# EAGLE design integration_test_board (EAGLE 6.3)
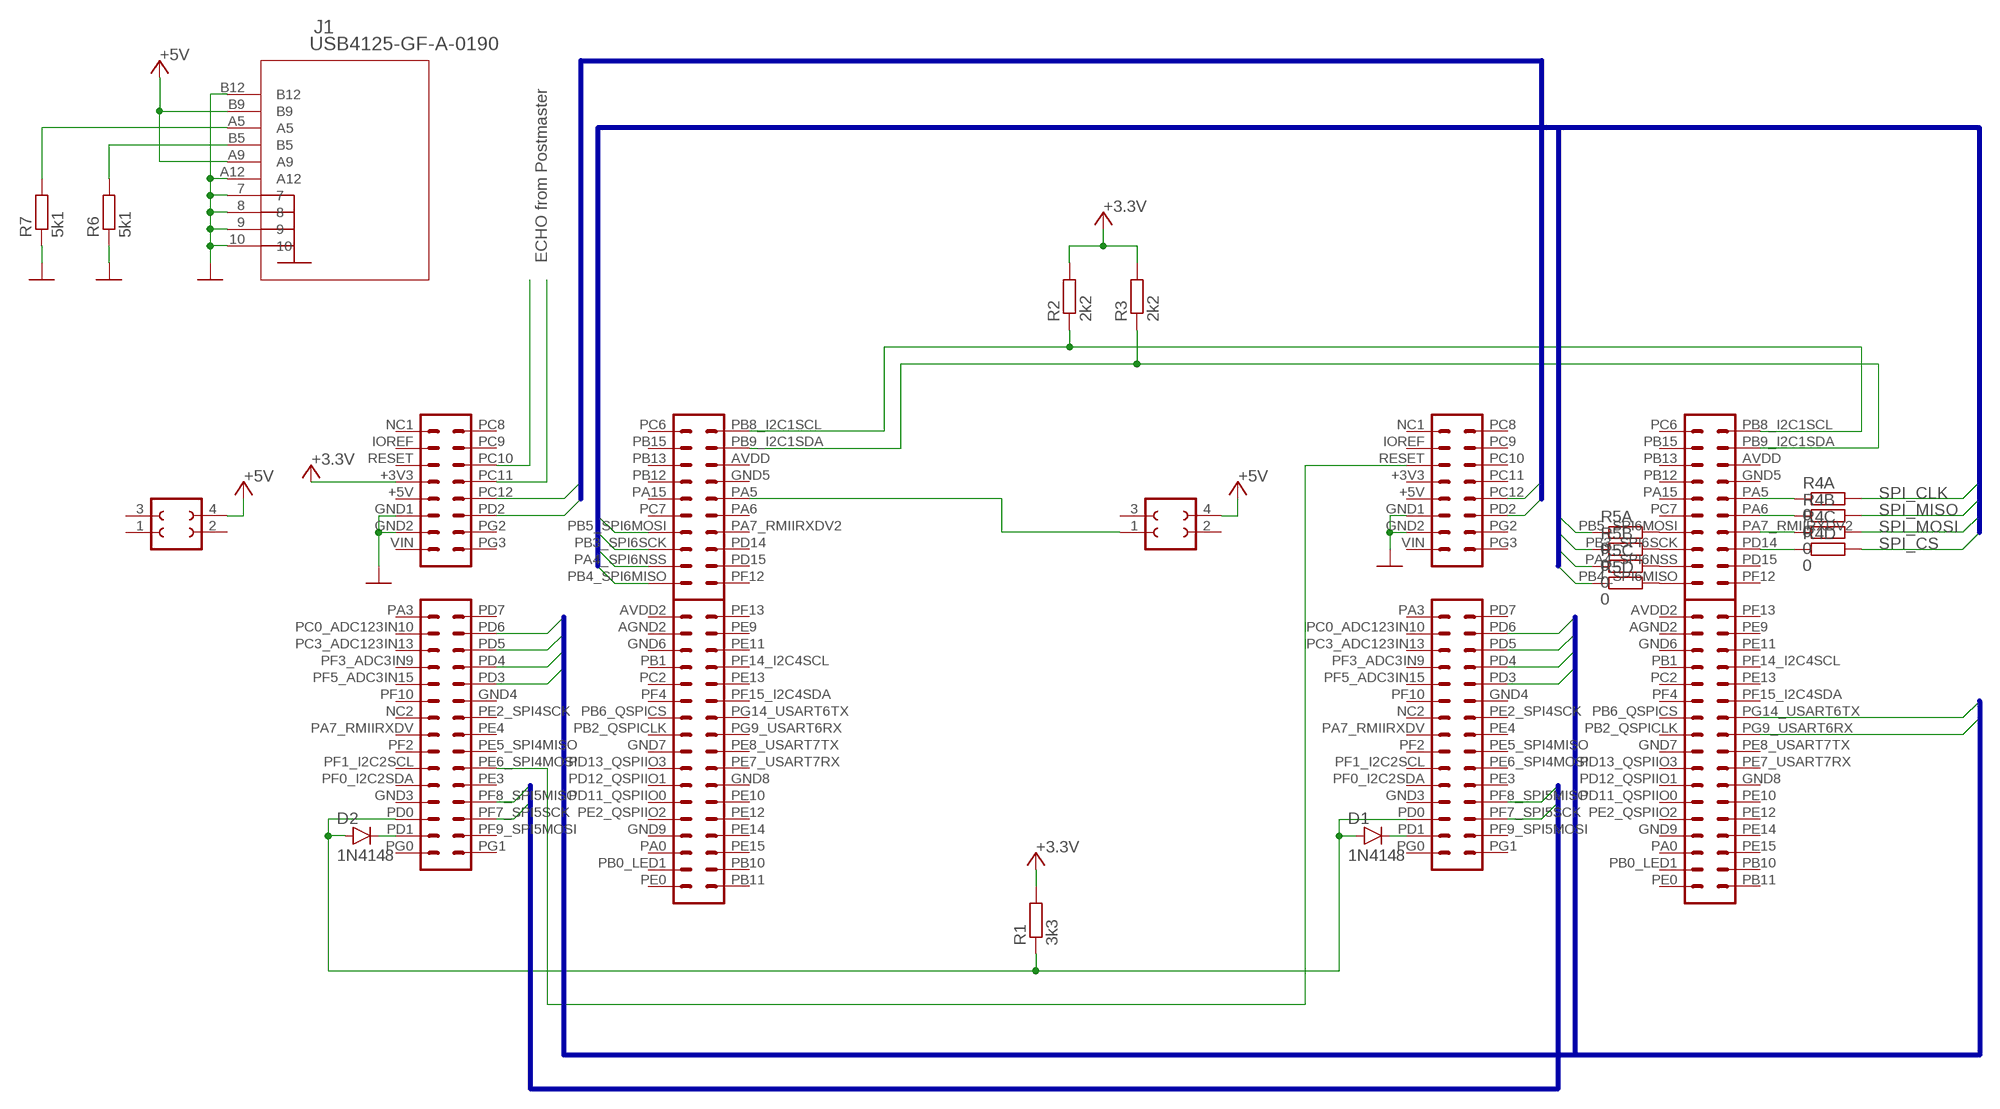
[diagram p0: schematic, sheet 1]

## Parts
D1  1N4148  [MINIMELF]
D2  1N4148  [MINIMELF]
J1  USB4125-GF-A-0190  [CONN6_125-GF-A-0190_GCT]
R1  3k3  RESISTORR0805  [0805]
R2  2k2  RESISTORR0805  [0805]
R3  2k2  RESISTORR0805  [0805]
R4  0  ARRAY-4RESISTOR  [ARRAY0603X4]
R5  0  ARRAY-4RESISTOR  [ARRAY0603X4]
R6  5k1  RESISTORR0805  [0805]
R7  5k1  RESISTORR0805  [0805]
U$1  NUCLEO-767  [NUCLEO-767]
U$2  NUCLEO-767  [NUCLEO-767]
U$4  HEADER-FEMALE-2-2  [HEADER-FEMALE-2-2]
U$5  HEADER-FEMALE-2-2  [HEADER-FEMALE-2-2]

## Nets
0V: J1.7 J1.8 J1.9 J1.10 J1.A12 J1.B12 R6.1 R7.1 U$1.GND1 U$1.GND2 U$2.GND1 U$2.GND2
+3.3V: R1.2 R2.2 R3.2 U$1.+3V3
+5V: J1.A9 J1.B9 U$4.4 U$5.4
ECHO_RX: U$1.PC12 U$2.PD2
ECHO_TX: U$1.PD2 U$2.PC12
GPIO_IN: U$1.PF7_SPI5SCK U$2.PF7_SPI5SCK
GPIO_OUT: U$1.PF8_SPI5MISO U$2.PF8_SPI5MISO
N$1: D1.A D2.A R1.1 U$1.PD0 U$2.PD0
N$2: D1.C U$2.PD1
N$3: D2.C U$1.PD1
N$4: R2.1 U$1.PB8_I2C1SCL U$2.PB8_I2C1SCL
N$5: R3.1 U$1.PB9_I2C1SDA U$2.PB9_I2C1SDA
N$6: U$1.PC10
N$7: U$1.PC11
N$8: U$1.PE6_SPI4MOSI U$2.RESET
N$9: R4.4 U$2.PD14
N$10: R4.3 U$2.PA7_RMIIRXDV2
N$11: R4.2 U$2.PA6
N$12: R4.1 U$2.PA5
N$13: R5.8 U$2.PB5_SPI6MOSI
N$14: R5.7 U$2.PB3_SPI6SCK
N$15: R5.6 U$2.PA4_SPI6NSS
N$16: R5.5 U$2.PB4_SPI6MISO
N$17: J1.B5 R6.2
N$18: J1.A5 R7.2
N$21: U$1.PA5 U$4.1
SPI_CLK: R4.8 R5.2 U$1.PB3_SPI6SCK
SPI_CS: R4.5 R5.3 U$1.PA4_SPI6NSS
SPI_MISO: R4.7 R5.4 U$1.PB4_SPI6MISO
SPI_MOSI: R4.6 R5.1 U$1.PB5_SPI6MOSI
UART_CTS: U$1.PD4 U$2.PD3
UART_RTR: U$1.PD3 U$2.PD4
UART_RX: U$1.PD5 U$2.PD6 U$2.PG9_USART6RX
UART_TX: U$1.PD6 U$2.PD5 U$2.PG14_USART6TX
Unconnected: U$1.+5V U$1.AGND2 U$1.AVDD U$1.AVDD2 U$1.GND3 U$1.GND4 U$1.GND5 U$1.GND6 U$1.GND7 U$1.GND8 U$1.GND9 U$1.IOREF U$1.NC1 U$1.NC2 U$1.PA0 U$1.PA3 U$1.PA6 U$1.PA7_RMIIRXDV U$1.PA7_RMIIRXDV2 U$1.PA15 U$1.PB0_LED1 U$1.PB1 U$1.PB2_QSPICLK U$1.PB6_QSPICS U$1.PB10 U$1.PB11 U$1.PB12 U$1.PB13 U$1.PB15 U$1.PC0_ADC123IN10 U$1.PC2 U$1.PC3_ADC123IN13 U$1.PC6 U$1.PC7 U$1.PC8 U$1.PC9 U$1.PD7 U$1.PD11_QSPIIO0 U$1.PD12_QSPIIO1 U$1.PD13_QSPIIO3 U$1.PD14 U$1.PD15 U$1.PE0 U$1.PE2_QSPIIO2 U$1.PE2_SPI4SCK U$1.PE3 U$1.PE4 U$1.PE5_SPI4MISO U$1.PE7_USART7RX U$1.PE8_USART7TX U$1.PE9 U$1.PE10 U$1.PE11 U$1.PE12 U$1.PE13 U$1.PE14 U$1.PE15 U$1.PF0_I2C2SDA U$1.PF1_I2C2SCL U$1.PF2 U$1.PF3_ADC3IN9 U$1.PF4 U$1.PF5_ADC3IN15 U$1.PF9_SPI5MOSI U$1.PF10 U$1.PF12 U$1.PF13 U$1.PF14_I2C4SCL U$1.PF15_I2C4SDA U$1.PG0 U$1.PG1 U$1.PG2 U$1.PG3 U$1.PG9_USART6RX U$1.PG14_USART6TX U$1.RESET U$1.VIN U$2.+3V3 U$2.+5V U$2.AGND2 U$2.AVDD U$2.AVDD2 U$2.GND3 U$2.GND4 U$2.GND5 U$2.GND6 U$2.GND7 U$2.GND8 U$2.GND9 U$2.IOREF U$2.NC1 U$2.NC2 U$2.PA0 U$2.PA3 U$2.PA7_RMIIRXDV U$2.PA15 U$2.PB0_LED1 U$2.PB1 U$2.PB2_QSPICLK U$2.PB6_QSPICS U$2.PB10 U$2.PB11 U$2.PB12 U$2.PB13 U$2.PB15 U$2.PC0_ADC123IN10 U$2.PC2 U$2.PC3_ADC123IN13 U$2.PC6 U$2.PC7 U$2.PC8 U$2.PC9 U$2.PC10 U$2.PC11 U$2.PD7 U$2.PD11_QSPIIO0 U$2.PD12_QSPIIO1 U$2.PD13_QSPIIO3 U$2.PD15 U$2.PE0 U$2.PE2_QSPIIO2 U$2.PE2_SPI4SCK U$2.PE3 U$2.PE4 U$2.PE5_SPI4MISO U$2.PE6_SPI4MOSI U$2.PE7_USART7RX U$2.PE8_USART7TX U$2.PE9 U$2.PE10 U$2.PE11 U$2.PE12 U$2.PE13 U$2.PE14 U$2.PE15 U$2.PF0_I2C2SDA U$2.PF1_I2C2SCL U$2.PF2 U$2.PF3_ADC3IN9 U$2.PF4 U$2.PF5_ADC3IN15 U$2.PF9_SPI5MOSI U$2.PF10 U$2.PF12 U$2.PF13 U$2.PF14_I2C4SCL U$2.PF15_I2C4SDA U$2.PG0 U$2.PG1 U$2.PG2 U$2.PG3 U$2.VIN U$4.2 U$4.3 U$5.1 U$5.2 U$5.3

## Buses
SPI_CS,SPI_CLK,SPI_MISO,SPI_MOSI
UART_TX,UART_RX,UART_RTR,UART_CTS
ECHO_TX,ECHO_RX
GPIO_IN,GPIO_OUT

## Notes on the sheet
- ECHO from Postmaster

## Library data of the parts
D1 D2 = diode:1N4148
J1 = header:USB4125-GF-A-0190; COPYRIGHT: Copyright (C) 2023 Ultra Librarian. All rights reserved.; MANUFACTURER_PART_NUMBER: USB4125-GF-A-0190; MFR_NAME: Global Connector Technology
R1-R3 R6 R7 = passive:RESISTOR
R4 R5 = passive:ARRAY-4RESISTOR
U$1 U$2 = header:NUCLEO-767
U$4 U$5 = header:HEADER-FEMALE-2-2

## Board
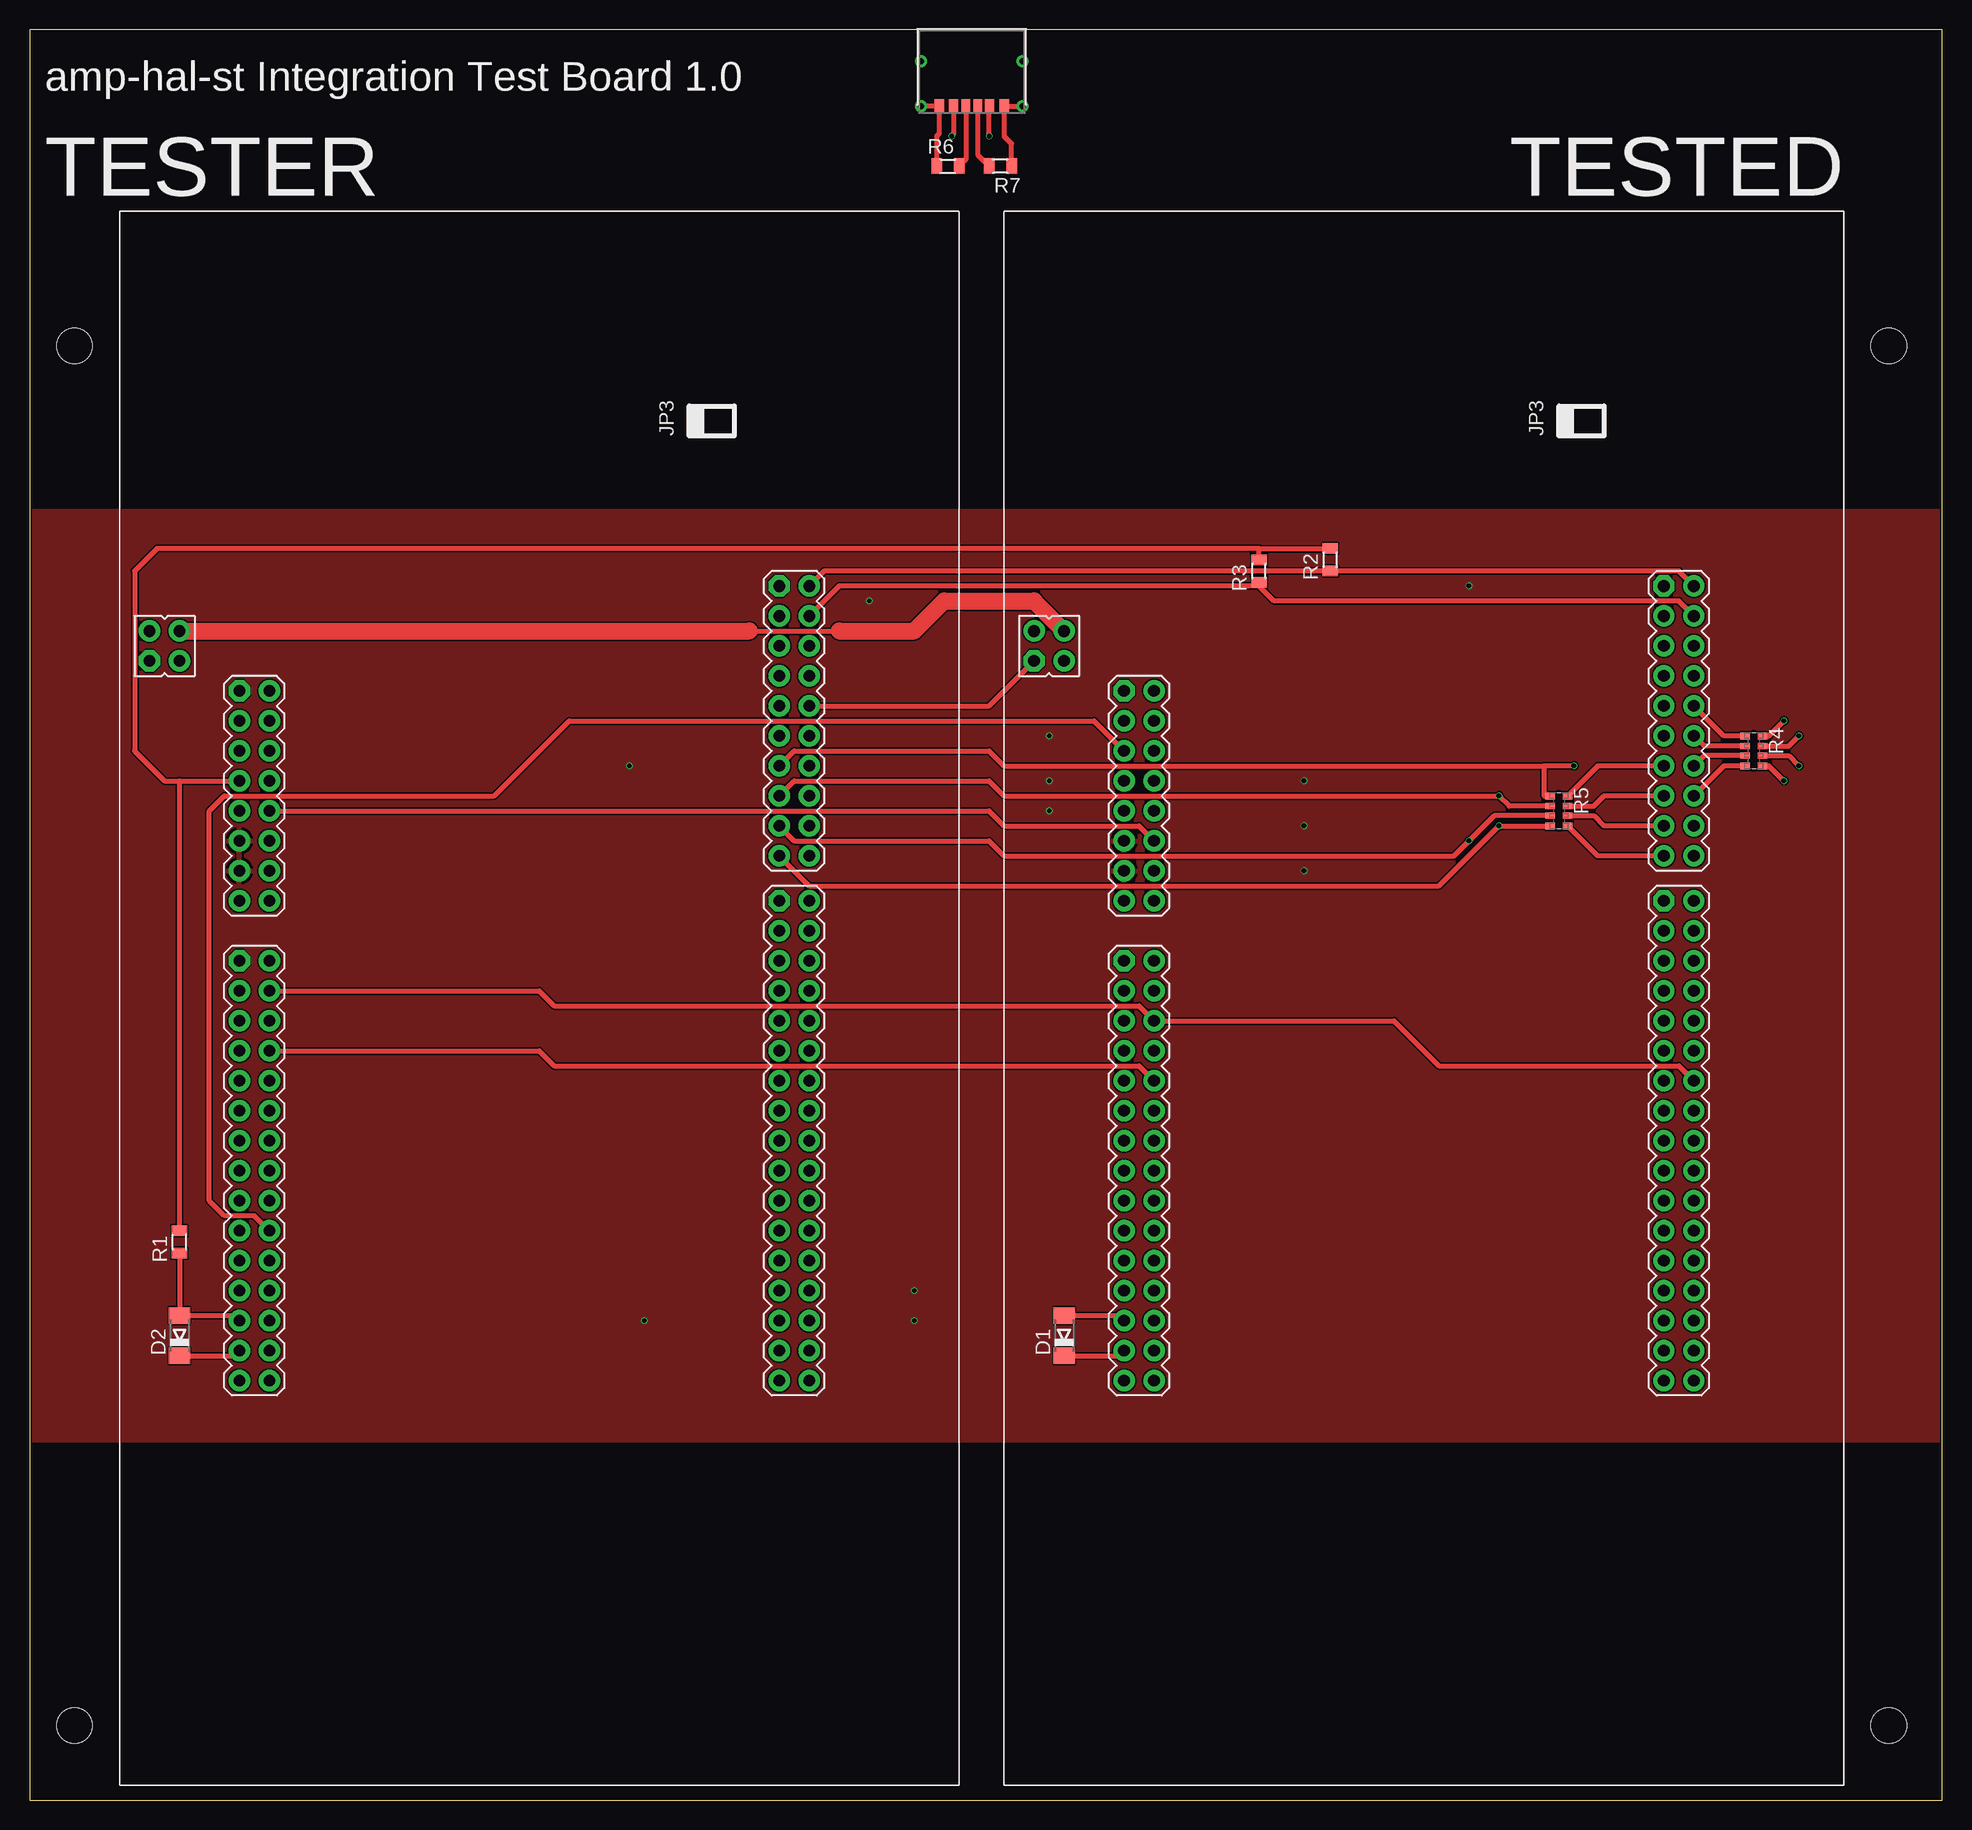
[diagram p1: board, top side]
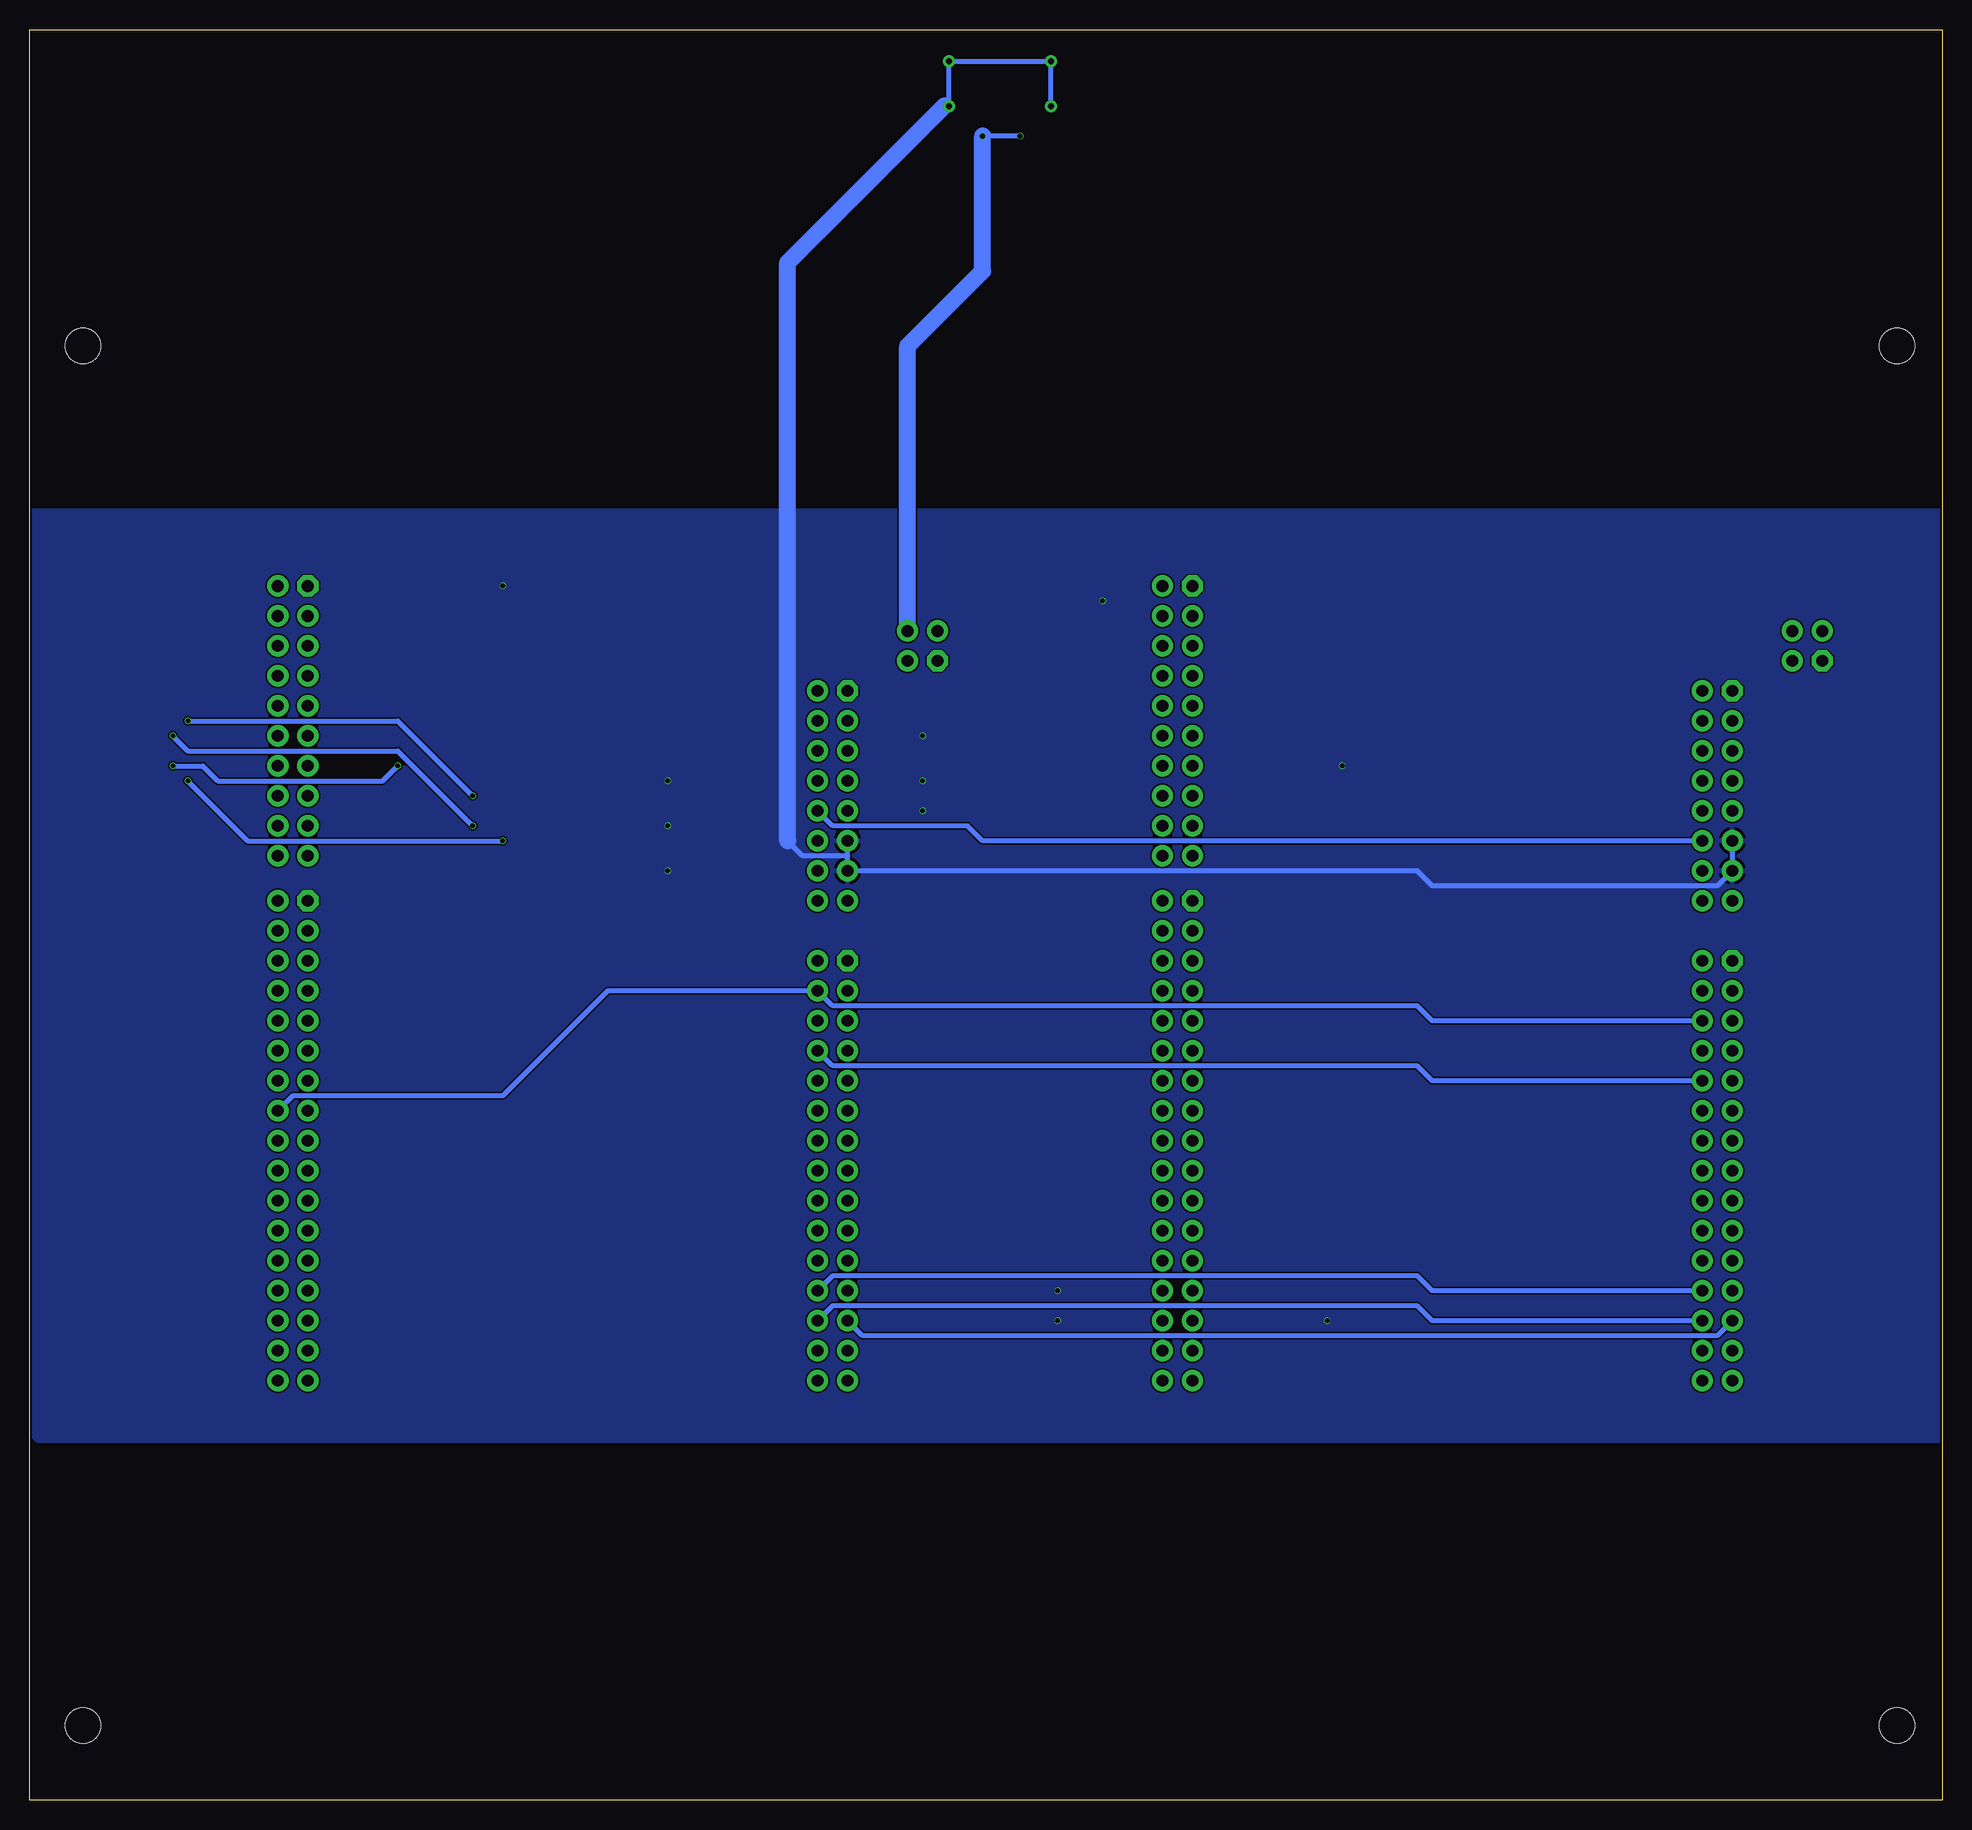
[diagram p2: board, bottom side, seen from below]

Size 162 x 150 mm. Coordinates in mm from the lower left corner, seen from the top.
Outline: 0,0 162,0 162,150 0,150 0,0
Copper layers (1*16): Top 0.035mm / dielectric 1.6mm / Bottom 0.035mm
Design rules "Jlcpcb": minimum track width 5mil, minimum drill 0.3mm, track to track 5mil, track to pad 5mil, pad to pad 5mil, via to via 5mil, smd to smd 5mil, copper to edge 0.2mm, drill to drill 6mil, minimum pad ring 10mil, minimum via ring 3mil, stop-mask expansion 4mil, vias tented up to drill 0mil, thermal gap 10mil
Holes 3 mm at 3.81,123.19 157.48,123.19 3.81,6.35 157.48,6.35

### Footprints (pad centres in the part's own frame; a part is rotated, then mirrored left to right if it is on the bottom)
MINIMELF = smd 1.4 x 1.8: A 1.7,0; C -1.7,0
CONN6_125-GF-A-0190_GCT = drill 0.508 pad 1: 7 -1.575,0; 8 7.061,0; 9 7.061,-3.81; 10 -1.575,-3.81 | smd 0.711 x 1.194: A5 2.25,0; B5 3.25,0 | smd 0.762 x 1.194: A9 4.27,0; B9 1.23,0 | smd 0.813 x 1.194: A12 5.5,0; B12 0,0
0805 = smd 0.889 x 1.321: 1 -0.635,0; 2 1.27,0
ARRAY0603X4 = smd 0.6 x 0.8: 1 -1.27,-0.75; 4 1.27,-0.75; 5 1.27,0.75; 8 -1.27,0.75 | smd 0.5 x 0.8: 2 -0.4,-0.75; 3 0.4,-0.75; 6 0.4,0.75; 7 -0.4,0.75
NUCLEO-767 = drill 1: +3V3 -25.4,10.16; +5V -25.4,7.62; AGND2 20.32,-2.54; AVDD 22.86,21.59; GND1 -25.4,5.08; GND2 -25.4,2.54; GND3 -25.4,-33.02; GND4 -22.86,-17.78; GND5 22.86,19.05; GND6 20.32,-5.08; GND7 20.32,-20.32; GND8 20.32,-33.02; GND9 22.86,-25.4; IOREF -25.4,15.24; NC2 -25.4,-20.32; PA0 20.32,-35.56; PA4_SPI6NSS 20.32,6.35; PA5 22.86,16.51; PA6 22.86,13.97; PA7_RMIIRXDV -25.4,-22.86; PA7_RMIIRXDV2 22.86,11.43; PA15 20.32,16.51; PB0_LED1 20.32,-38.1; PB1 20.32,-7.62; PB2_QSPICLK 20.32,-17.78; PB3_SPI6SCK 20.32,8.89; PB4_SPI6MISO 20.32,3.81; PB5_SPI6MOSI 20.32,11.43; PB6_QSPICS 20.32,-15.24; PB8_I2C1SCL 22.86,26.67; PB9_I2C1SDA 22.86,24.13; PB10 22.86,-38.1; PB11 22.86,-40.64; PB12 20.32,19.05; PB13 20.32,21.59; PB15 20.32,24.13; PC0_ADC123IN10 -25.4,-7.62; PC2 20.32,-10.16; PC3_ADC123IN13 -25.4,-10.16; PC7 20.32,13.97; PC8 -22.86,17.78; PC9 -22.86,15.24; PC10 -22.86,12.7; PC11 -22.86,10.16; PC12 -22.86,7.62; PD0 -25.4,-35.56; PD1 -25.4,-38.1; PD2 -22.86,5.08; PD3 -22.86,-15.24; PD4 -22.86,-12.7; PD5 -22.86,-10.16; PD6 -22.86,-7.62; PD7 -22.86,-5.08; PD11_QSPIIO0 20.32,-27.94; PD12_QSPIIO1 20.32,-25.4; PD13_QSPIIO3 20.32,-22.86; PD14 22.86,8.89; PD15 22.86,6.35; PE0 20.32,-40.64; PE2_QSPIIO2 20.32,-30.48; PE2_SPI4SCK -22.86,-20.32; PE3 -22.86,-30.48; PE4 -22.86,-22.86; PE5_SPI4MISO -22.86,-25.4; PE6_SPI4MOSI -22.86,-27.94; PE7_USART7RX 22.86,-22.86; PE8_USART7TX 22.86,-20.32; PE9 22.86,-2.54; PE10 22.86,-27.94; PE11 22.86,-5.08; PE12 22.86,-30.48; PE13 22.86,-10.16; PE14 22.86,-33.02; PE15 22.86,-35.56; PF0_I2C2SDA -25.4,-30.48; PF1_I2C2SCL -25.4,-27.94; PF2 -25.4,-25.4; PF3_ADC3IN9 -25.4,-12.7; PF4 20.32,-12.7; PF5_ADC3IN15 -25.4,-15.24; PF7_SPI5SCK -22.86,-35.56; PF8_SPI5MISO -22.86,-33.02; PF9_SPI5MOSI -22.86,-38.1; PF10 -25.4,-17.78; PF12 22.86,3.81; PF13 22.86,0; PF14_I2C4SCL 22.86,-7.62; PF15_I2C4SDA 22.86,-12.7; PG0 -25.4,-40.64; PG1 -22.86,-40.64; PG2 -22.86,2.54; PG3 -22.86,0; PG9_USART6RX 22.86,-17.78; PG14_USART6TX 22.86,-15.24; RESET -25.4,12.7; VIN -25.4,0 | drill 1 octagon: AVDD2 20.32,0; NC1 -25.4,17.78; PA3 -25.4,-5.08; PC6 20.32,26.67
HEADER-FEMALE-2-2 = drill 1 octagon: 1 -1.27,-1.27 | drill 1: 2 -1.27,1.27; 3 1.27,-1.27; 4 1.27,1.27

### Placement (x,y rotation side)
D1  87.63,39.37 90 top
D2  12.7,39.37 90 top
J1  82.55,143.51 180 top
R1  12.7,46.99 90 top
R2  110.17,104.78 90 top
R3  104.14,103.82 90 top
R4  146.05,88.9 270 top
R5  129.54,83.82 270 top
R6  77.47,138.43 0 top
R7  82.55,138.43 180 top
U$1  43.18,76.2 0 top
U$2  118.11,76.2 0 top
U$4  86.36,97.79 0 top
U$5  11.43,97.79 0 top

### Tracks (layer width: path | path; a pad name or v marks a point on that pad's centre or on a via)
0V  (via drill 0.4)
  Top 0.406: J1.7 J1.B12 82.55,140.97 83.19,140.34 R7.1 | J1.8 J1.A12 77.05,141.19 76.83,140.97 R6.1
  Bottom 0.406: U$1.GND1 U$1.GND2 19.05,77.47 43.18,77.47 44.45,78.74 U$2.GND2 92.71,80.01 | 92.71,80.01 U$2.GND1 | 92.71,80.01 96.52,80.01 97.79,81.28 | J1.8 J1.9 J1.10 J1.7 84.53,143.51
  Bottom 1.422: 97.79,81.28 97.79,130.25 84.53,143.51
  other vias: 50.8,87.63 86.36,90.17 86.36,86.36 86.36,83.82 107.95,86.36 107.95,82.55 107.95,78.74 121.92,102.87 74.93,43.18 74.93,40.64 52.07,40.64 71.12,101.6
  pour Bottom: 0,30.48 0,109.22 162.56,109.22 162.56,31.75 161.29,30.48
  pour Top: 0,30.48 0,109.22 162.56,109.22 162.56,30.48
+3.3V
  Top 0.406: R1.2 12.7,86.36 | 12.7,86.36 U$1.+3V3 | R3.2 104.14,106.05 | 104.14,106.05 R2.2 | 104.14,106.05 10.79,106.05 8.89,104.14 8.89,88.9 11.43,86.36 12.7,86.36
+5V  (via drill 0.4)
  Top 0.406: 60.96,99.06 68.58,99.06 | v81.28,140.97 81.28,143.47 J1.B9 | J1.A9 78.28,141.15 v78.11,140.97
  Top 1.422: U$5.4 60.96,99.06 | 68.58,99.06 74.93,99.06 77.47,101.6 85.09,101.6 U$4.4
  Bottom 0.406: v78.11,140.97 v81.28,140.97
  Bottom 1.422: U$4.4 87.63,123.19 81.28,129.54 v81.28,140.97
ECHO_RX
  Top 0.406: U$1.PC12 81.28,83.82 82.55,82.55 93.98,82.55 U$2.PD2
ECHO_TX
  Bottom 0.406: U$1.PD2 81.28,81.28 82.55,82.55 93.98,82.55 U$2.PC12
GPIO_IN
  Bottom 0.406: U$1.PF7_SPI5SCK 43.18,40.64 44.45,41.91 93.98,41.91 U$2.PF7_SPI5SCK
GPIO_OUT
  Bottom 0.406: U$1.PF8_SPI5MISO 43.18,43.18 44.45,44.45 93.98,44.45 U$2.PF8_SPI5MISO
N$1
  Top 0.406: U$1.PD0 17.35,41.07 D2.A R1.1 | D1.A 92.28,41.07 U$2.PD0
  Bottom 0.406: U$1.PD0 19.05,39.37 91.44,39.37 U$2.PD0
N$2
  Top 0.406: D1.C 92.28,37.67 U$2.PD1
N$3
  Top 0.406: D2.C 17.35,37.67 U$1.PD1
N$4
  Top 0.406: U$2.PB8_I2C1SCL 139.7,104.14 R2.1 67.31,104.14 U$1.PB8_I2C1SCL
N$5
  Top 0.406: U$2.PB9_I2C1SDA 139.7,101.6 105.41,101.6 104.14,102.87 | 104.14,102.87 68.58,102.87 U$1.PB9_I2C1SDA | R3.1 104.14,102.87
N$8
  Top 0.406: U$1.PE6_SPI4MOSI 19.05,49.53 16.51,49.53 15.24,50.8 15.24,83.82 16.51,85.09 39.37,85.09 45.72,91.44 90.17,91.44 U$2.RESET
N$9
  Top 0.406: R4.4 143.51,87.63 U$2.PD14
N$10
  Top 0.406: R4.3 141.84,88.5 U$2.PA7_RMIIRXDV2
N$11
  Top 0.406: R4.2 141.84,89.3 U$2.PA6
N$12
  Top 0.406: R4.1 143.51,90.17 U$2.PA5
N$13
  Top 0.406: U$2.PB5_SPI6MOSI 132.83,87.63 R5.8
N$14
  Top 0.406: U$2.PB3_SPI6SCK 133.35,85.09 132.48,84.22 R5.7
N$15
  Top 0.406: U$2.PA4_SPI6NSS 133.35,82.55 132.48,83.42 R5.6
N$16
  Top 0.406: U$2.PB4_SPI6MISO 132.83,80.01 R5.5
N$17
  Top 0.406: J1.B5 79.3,138.99 R6.2
N$18
  Top 0.406: J1.A5 80.3,139.41 R7.2
N$21
  Top 0.406: U$1.PA5 81.28,92.71 U$4.1
SPI_CLK  (via drill 0.4)
  Top 0.406: U$1.PB3_SPI6SCK 64.77,86.36 81.28,86.36 82.55,85.09 v124.46,85.09 125.33,84.22 R5.2 | R4.8 147.32,90.17 v148.59,91.44
  Bottom 0.406: v148.59,91.44 130.81,91.44 v124.46,85.09
SPI_CS  (via drill 0.4)
  Top 0.406: U$1.PA4_SPI6NSS 64.77,81.28 81.28,81.28 82.55,80.01 120.65,80.01 v121.92,81.28 124.06,83.42 R5.3 | R4.5 147.32,87.63 v148.59,86.36
  Bottom 0.406: v148.59,86.36 143.51,81.28 v121.92,81.28
SPI_MISO  (via drill 0.4)
  Top 0.406: U$1.PB4_SPI6MISO 66.04,77.47 119.38,77.47 v124.46,82.55 R5.4 | R4.7 148.99,89.3 v149.86,90.17
  Bottom 0.406: v149.86,90.17 148.59,88.9 130.81,88.9 v124.46,82.55
SPI_MOSI  (via drill 0.4)
  Top 0.406: U$1.PB5_SPI6MOSI 64.77,88.9 81.28,88.9 82.55,87.63 128.27,87.63 | 128.27,87.63 128.27,85.09 R5.1 | R4.6 148.99,88.5 v149.86,87.63 | v130.81,87.63 128.27,87.63
  Bottom 0.406: v149.86,87.63 147.32,87.63 146.05,86.36 132.08,86.36 v130.81,87.63
UART_CTS
  Top 0.406: U$1.PD4 43.18,63.5 44.45,62.23 93.98,62.23 U$2.PD3
UART_RTR
  Bottom 0.406: U$1.PD3 43.18,60.96 44.45,62.23 93.98,62.23 U$2.PD4
UART_RX
  Bottom 0.406: U$1.PD5 43.18,66.04 44.45,67.31 93.98,67.31 U$2.PD6 113.03,68.58 121.92,59.69 139.7,59.69 U$2.PG9_USART6RX
UART_TX
  Top 0.406: U$1.PD6 43.18,68.58 44.45,67.31 93.98,67.31 U$2.PD5 115.57,66.04 119.38,62.23 139.7,62.23 U$2.PG14_USART6TX

### Text on the board
tPlace: amp-hal-st Integration Test Board 1.0 | TESTED | TESTER | JP3 | JP3